# Altium schematic sheet Sheet3.SchDoc
size A4; SheetNumber: 1; SheetTotal: 1
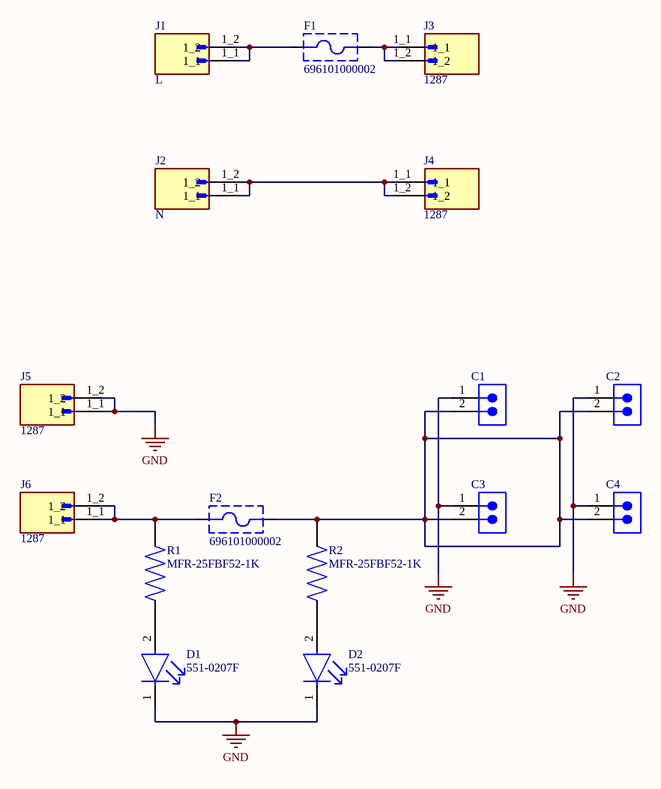
[diagram p0: Sheet3.SchDoc]

## Parts
C1  691313510002  [691313510002]  (value not drawn)
C2  691313510002  [691313510002]  (value not drawn)
C3  691313510002  [691313510002]  (value not drawn)
C4  691313510002  [691313510002]  (value not drawn)
D1  551-0207F  [FP-551-0207F-MFG]
D2  551-0207F  [FP-551-0207F-MFG]
F1  696101000002  [696101000002]
F2  696101000002  [696101000002]
J1  L  [KEYSTONE_1287]
J2  N  [KEYSTONE_1287]
J3  1287  [KEYSTONE_1287]
J4  1287  [KEYSTONE_1287]
J5  1287  [KEYSTONE_1287]
J6  1287  [KEYSTONE_1287]
R1  MFR-25FBF52-1K  [RESAD1100W55L680D260]
R2  MFR-25FBF52-1K  [RESAD1100W55L680D260]

## Nets
GND: C1.1 C2.1 C3.1 C4.1 D1.1(C) D2.1(C) J5.1_1 J5.1_2
NetC1_2: C1.2 C2.2 C3.2 C4.2 F2.2 R2.2
NetD1_2: D1.2(A) R1.1
NetD2_2: D2.2(A) R2.1
NetF1_1: F1.1 J1.1_1 J1.1_2
NetF1_2: F1.2 J3.1_1 J3.1_2
NetF2_1: F2.1 J6.1_1 J6.1_2 R1.2
NetJ2_1_1: J2.1_1 J2.1_2 J4.1_1 J4.1_2

## Library data of the parts
C1-C4 = CMP-1502-02192-3: 313; 5.08MM Pitch Straight Pluggable Term Block, Pcb Header, Through Hole, 2 Way; Number of Contacts: 2; Voltage: 300V; Number of Levels: 1; Color: Green; Gender: Male; Current: 20A; Pitch: 5.08mm; Number of Pins: 2; RoHS: Compliant; Length: 11.5mm; Width: 12.16mm; Packaging: Box; Max Operating Temperature: 105°C; Lead Pitch: 5.08mm; Mount: Through Hole; Number of Rows: 1; Voltage Rating: 300V; Contact Material: Tin; Height: 8.7mm; Contact Plating: Tin; Termination: Solder; Min Operating Temperature: -40°C; Number of Positions Per Level: 2; Current Rating: 20A
D1 D2 = CMP-15384-000011-1: LED 3MM HIGH EFF GREEN; Viewing Angle: 45°; Lens Size: 5mm; Dominant Wavelength: 563nm; Test Current: 10mA; Power Dissipation: 75mW; Luminous Intensity: 16mcd; Operating Supply Voltage: 2.1V; Reverse Voltage: 3V; Number of LEDs: 1; Lens Style: Diffused; Element Configuration: Single; Mount: Through Hole; Series: 551; Lead Free: Lead Free; Number of Pins: 2; Width: 4.32mm; Packaging: Bulk; Color: Green; REACH SVHC: No SVHC; Lens Color: Green; Package Quantity: 100; Min Operating Temperature: -25°C; Forward Current: 10mA; Height: 7.11mm; RoHS Compliant: Yes; Illumination Color: Green; Number of Elements: 1; Voltage Rating: 2.1V; Radiation Hardening: No; Length: 4.32mm; Depth: 8.89mm; Forward Voltage: 2.1V; Current: 10mA; Wavelength: 563nm; Orientation: Right Angle; Max Operating Temperature: 85°C
F1 F2 = CMP-1502-00233-4: WR-FSH Fuse Holder Blocks Fuse Holder Blocks Clip Cover for PCB; Fuse Current: 10A; Voltage Rating (AC): 250V; Mount: Through Hole; REACH SVHC: Unknown; RoHS: Compliant; Height: 13.6mm; Packaging: Box; Min Operating Temperature: -30°C; Max Operating Temperature: 120°C
J1-J6 = 1287: Male .250 Quick Fit Terminal; MF: Keystone Electronics Corp.; SnapEDA_Link: https://www.snapeda.com/parts/1287/Keystone/view-part/?ref=snap; Package: None; Value: *; MP: 1287; Check_prices: https://www.snapeda.com/parts/1287/Keystone/view-part/?ref=eda
R1 R2 = MFR-25FBF52-1K: 1.07 kOhms Â±1% 0.25W, 1/4W Through Hole Resistor Axial - Metal Film; MF: Yageo; SnapEDA_Link: https://www.snapeda.com/parts/MFR-25FBF52-1K/Yageo/view-part/?ref=snap; Package: RADIAL-2 YAGEO; Value: *; MP: MFR-25FBF52-1K; Check_prices: https://www.snapeda.com/parts/MFR-25FBF52-1K/Yageo/view-part/?ref=eda